# EAGLE design test (EAGLE 8.3.2)
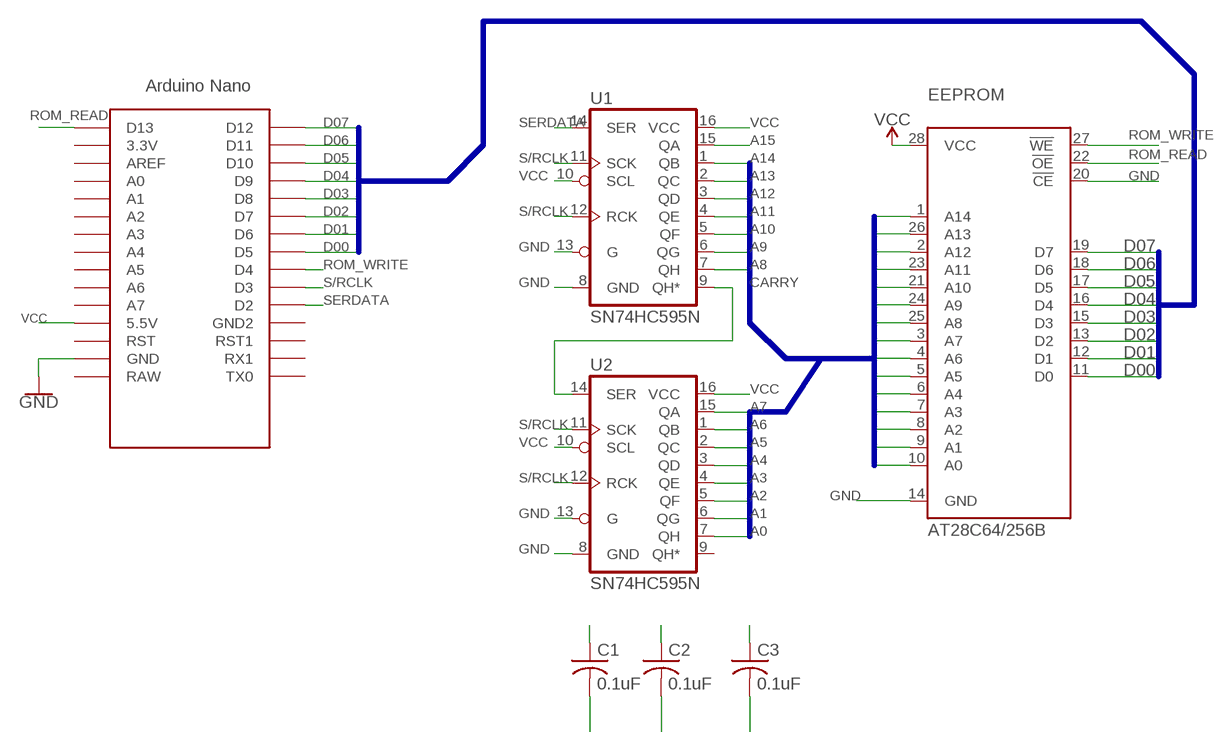
[diagram p0: schematic, sheet 1]

## Parts
C1  0.1uF  C-US025-030X050  [C025-030X050]
C2  0.1uF  C-US025-030X050  [C025-030X050]
C3  0.1uF  C-US025-030X050  [C025-030X050]
EEPROM  AT28C64/256B  28C256AP  [DIL28-6]
U1  SN74HC595N  74HC595N  [DIP16]
U2  SN74HC595N  74HC595N  [DIP16]
U$1  NANO  [NANO]

## Nets
A0: EEPROM.10(A0) U2.7(QH)
A1: EEPROM.9(A1) U2.6(QG)
A2: EEPROM.8(A2) U2.5(QF)
A3: EEPROM.7(A3) U2.4(QE)
A4: EEPROM.6(A4) U2.3(QD)
A5: EEPROM.5(A5) U2.2(QC)
A6: EEPROM.4(A6) U2.1(QB)
A7: EEPROM.3(A7) U2.15(QA)
A8: EEPROM.25(A8) U1.7(QH)
A9: EEPROM.24(A9) U1.6(QG)
A10: EEPROM.21(A10) U1.5(QF)
A11: EEPROM.23(A11) U1.4(QE)
A12: EEPROM.2(A12) U1.3(QD)
A13: EEPROM.26(A13) U1.2(QC)
A14: EEPROM.1(A14) U1.1(QB)
A15: U1.15(QA)
CARRY: U1.9(QH*) U2.14(SER)
D00: EEPROM.11(D0) U$1.D5
D01: EEPROM.12(D1) U$1.D6
D02: EEPROM.13(D2) U$1.D7
D03: EEPROM.15(D3) U$1.D8
D04: EEPROM.16(D4) U$1.D9
D05: EEPROM.17(D5) U$1.D10
D06: EEPROM.18(D6) U$1.D11
D07: EEPROM.19(D7) U$1.D12
GND [thick]: C1.2 C2.2 C3.2 EEPROM.14(GND) EEPROM.20(!CE) U1.8(GND) U1.13(G) U2.8(GND) U2.13(G) U$1.GND
ROM_READ: EEPROM.22(!OE) U$1.D13
ROM_WRITE: EEPROM.27(!WE) U$1.D4
S/RCLK: U1.11(SCK) U1.12(RCK) U2.11(SCK) U2.12(RCK) U$1.D3
SERDATA: U1.14(SER) U$1.D2
VCC [thick]: C1.1 C2.1 C3.1 EEPROM.28(VCC) U1.10(SCL) U1.16(VCC) U2.10(SCL) U2.16(VCC) U$1.5V(5.5V)
Unconnected: U2.9(QH*) U$1.3.3V U$1.A0 U$1.A1 U$1.A2 U$1.A3 U$1.A4 U$1.A5 U$1.A6 U$1.A7 U$1.AREF U$1.GND1(GND2) U$1.ICSP1 U$1.ICSP2 U$1.ICSP3 U$1.ICSP4 U$1.ICSP5 U$1.ICSP6 U$1.RAW U$1.RST U$1.RST1 U$1.RX1 U$1.TX0

## Buses
D[0..7]
A[0..14]

## Library data of the parts
C1-C3 = adafruit:C-US: CAPACITOR, American symbol
EEPROM = microchip:28*256A: CMOS EEPROM 256 K (32 K x 8), low voltage; MPN: AT28C256B-15PU; OC_FARNELL: 1631144; OC_NEWARK: 96K6557
U1 U2 = SparkFun-IC-Logic:74*595: 8-Bit Shift Register (Serial to Parallel) Datasheet <http://cdn.sparkfun.com/datasheets/BreakoutBoards/MM74HC595.pdf> SparkFun Products SparkFun Shift Register Breakout - 74HC595 <https://www.sparkfun.com/products/10680> (BOB-10680); PROD_ID: IC-13123
U$1 = Arduino-clone:NANO: Arduino Nano

## Net classes
0 default: width 0.254 mm, drill 0.254 mm, clearance 0.254 mm
1 thick: width 0.762 mm, drill 0.381 mm, clearance 0.381 mm

## Board
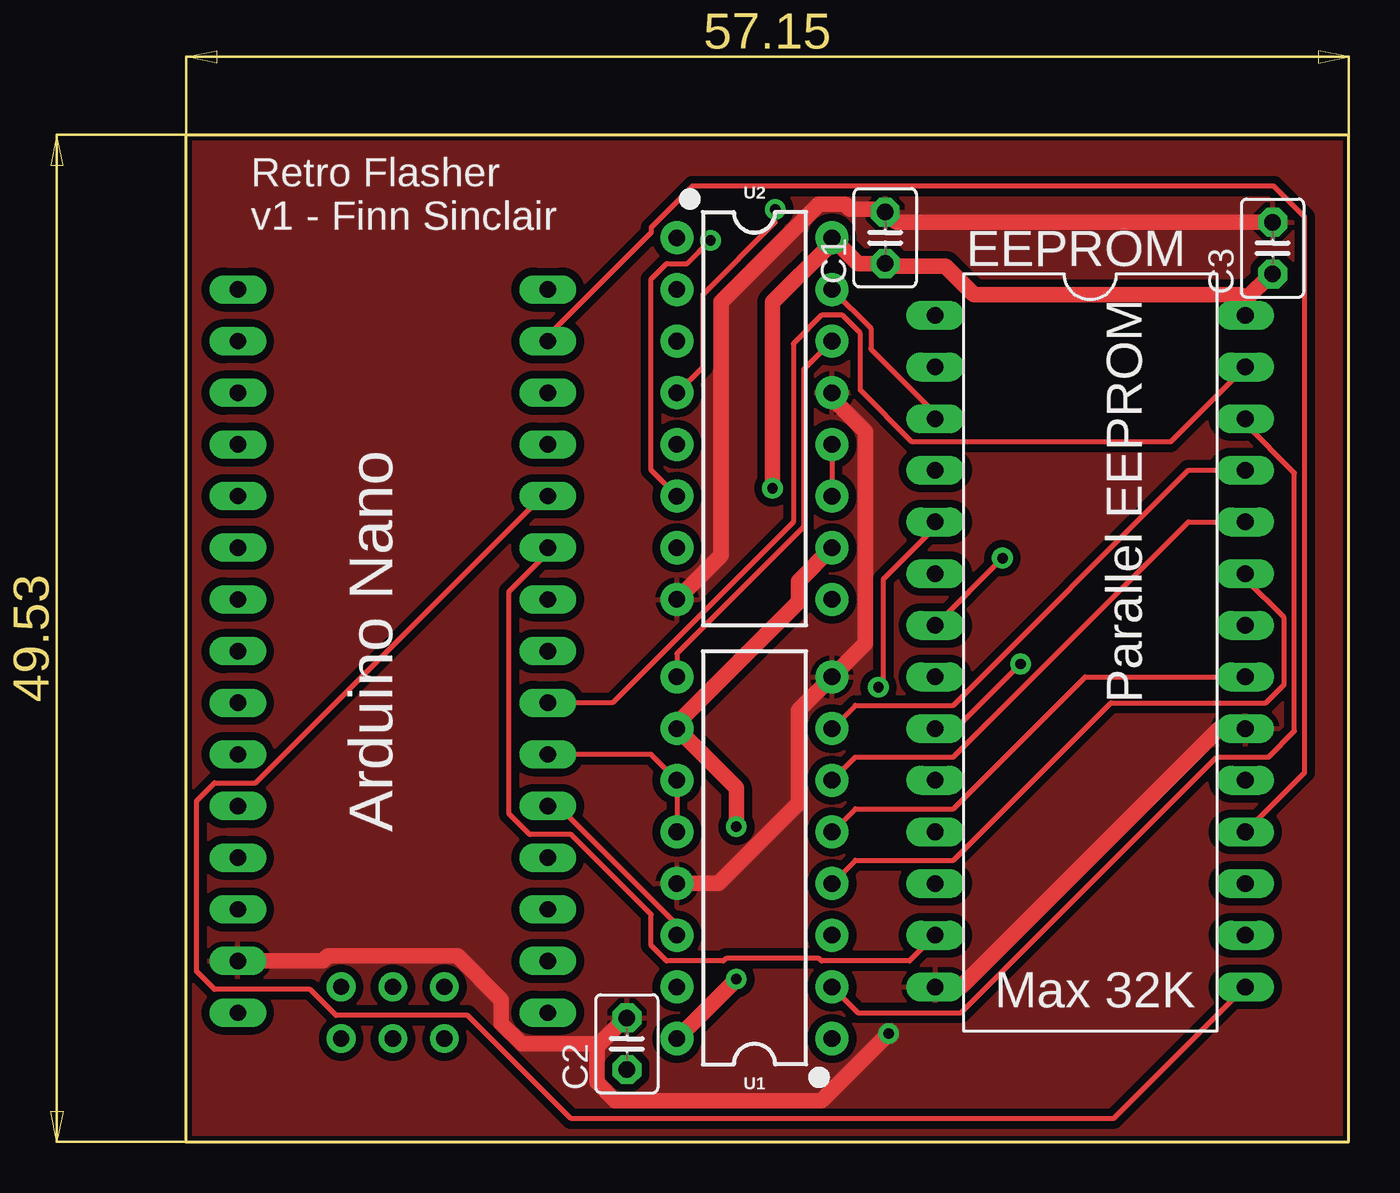
[diagram p1: board, top side]
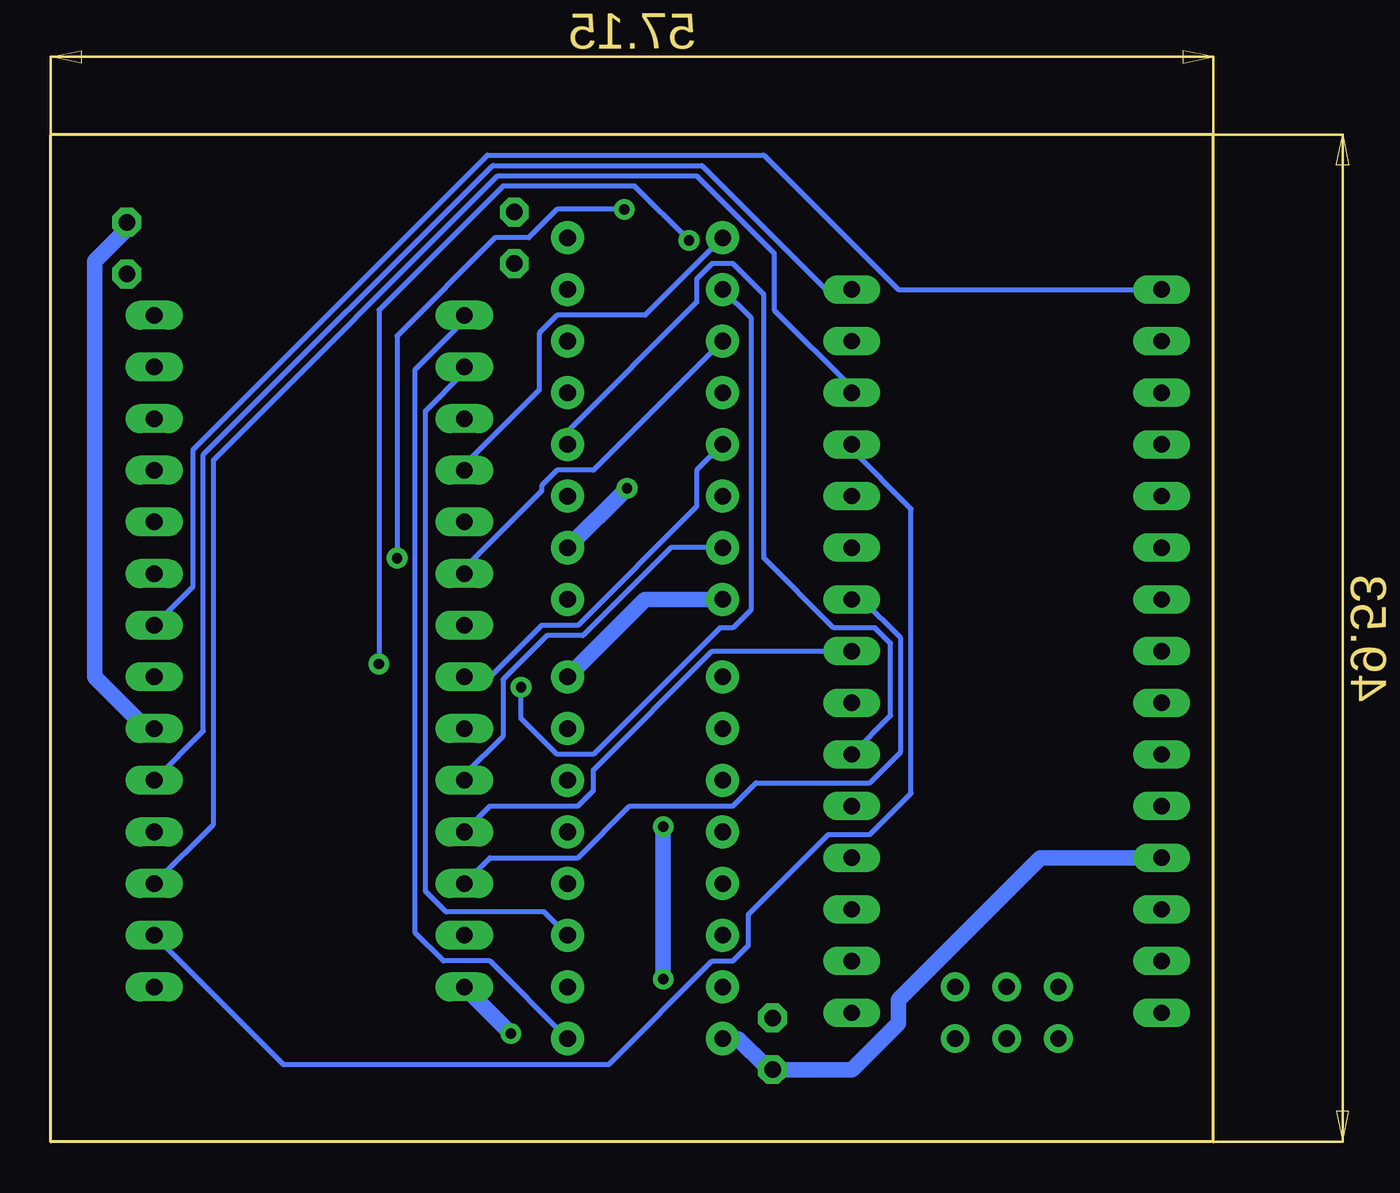
[diagram p2: board, bottom side, seen from below]

Size 57.15 x 49.53 mm. Coordinates in mm from the lower left corner, seen from the top.
Outline: 0,0 57.15,0 57.15,49.53 0,49.53 0,0
Copper layers (1*16): Top 0.035mm / dielectric 1.5mm / Bottom 0.035mm
Design rules "SparkFun": minimum track width 8mil, minimum drill 20mil, track to track 8mil, track to pad 8mil, pad to pad 8mil, via to via 8mil, smd to smd 8mil, copper to edge 8mil, drill to drill 8mil, minimum pad ring 12mil, minimum via ring 10mil, stop-mask expansion 4mil, vias tented up to drill 20mil, thermal gap 10mil

### Footprints (pad centres in the part's own frame; a part is rotated, then mirrored left to right if it is on the bottom)
C025-030X050 = drill 0.813 pad 1.422 octagon: 1 -1.27,0; 2 1.27,0
DIL28-6 = drill 0.813 long: 1 -16.51,-7.62; 2 -13.97,-7.62; 3 -11.43,-7.62; 4 -8.89,-7.62; 5 -6.35,-7.62; 6 -3.81,-7.62; 7 -1.27,-7.62; 8 1.27,-7.62; 9 3.81,-7.62; 10 6.35,-7.62; 11 8.89,-7.62; 12 11.43,-7.62; 13 13.97,-7.62; 14 16.51,-7.62; 15 16.51,7.62; 16 13.97,7.62; 17 11.43,7.62; 18 8.89,7.62; 19 6.35,7.62; 20 3.81,7.62; 21 1.27,7.62; 22 -1.27,7.62; 23 -3.81,7.62; 24 -6.35,7.62; 25 -8.89,7.62; 26 -11.43,7.62; 27 -13.97,7.62; 28 -16.51,7.62
DIP16 = drill 0.813 pad 1.626: 1 -8.89,-3.81; 2 -6.35,-3.81; 3 -3.81,-3.81; 4 -1.27,-3.81; 5 1.27,-3.81; 6 3.81,-3.81; 7 6.35,-3.81; 8 8.89,-3.81; 9 8.89,3.81; 10 6.35,3.81; 11 3.81,3.81; 12 1.27,3.81; 13 -1.27,3.81; 14 -3.81,3.81; 15 -6.35,3.81; 16 -8.89,3.81
NANO = drill 0.8 long: 3.3V -10.16,24.13; 5V -10.16,-1.27; A0 -10.16,19.05; A1 -10.16,16.51; A2 -10.16,13.97; A3 -10.16,11.43; A4 -10.16,8.89; A5 -10.16,6.35; A6 -10.16,3.81; A7 -10.16,1.27; AREF -10.16,21.59; D2 5.08,1.27; D3 5.08,3.81; D4 5.08,6.35; D5 5.08,8.89; D6 5.08,11.43; D7 5.08,13.97; D8 5.08,16.51; D9 5.08,19.05; D10 5.08,21.59; D11 5.08,24.13; D12 5.08,26.67; D13 -10.16,26.67; GND -10.16,-6.35; GND1 5.08,-1.27; RAW -10.16,-8.89; RST -10.16,-3.81; RST1 5.08,-3.81; RX1 5.08,-6.35; TX0 5.08,-8.89 | drill 0.8: ICSP1 -5.08,-10.16; ICSP2 -5.08,-7.62; ICSP3 -2.54,-10.16; ICSP4 -2.54,-7.62; ICSP5 0,-10.16; ICSP6 0,-7.62

### Placement (x,y rotation side)
C1  34.37,44.45 90 top
C2  21.67,4.83 90 top
C3  53.42,43.94 90 top
EEPROM  44.45,24.13 270 top
U1  27.94,13.97 90 top
U2  27.94,35.56 270 top
U$1  12.7,15.24 0 top

### Tracks (layer width: path | path; a pad name or v marks a point on that pad's centre or on a via)
A0
  Bottom 0.254: EEPROM.10 36.83,18.03 34.92,19.94 34.92,22.73 32.77,24.89 30.99,24.89 26.67,29.21 U2.7
A1  (via drill 0.51)
  Top 0.254: EEPROM.9 37.85,20.32 v41.02,23.5 | v25.78,44.32 24.64,43.18 23.62,43.18 22.86,42.42 22.86,33.02 U2.6
  Bottom 0.254: v41.02,23.5 41.02,40.89 34.92,46.99 28.45,46.99 v25.78,44.32
A2
  Bottom 0.254: EEPROM.8 35.56,22.86 33.02,25.4 31.24,25.4 25.4,31.24 25.4,33.02 U2.5
A3  (via drill 0.51)
  Top 0.254: v40.13,28.7 EEPROM.7 | v28.96,45.85 28.96,45.21 25.4,41.66 25.4,38.1 U2.4
  Bottom 0.254: v40.13,28.7 40.13,39.62 35.31,44.45 33.66,44.45 32.26,45.85 v28.96,45.85
A4
  Bottom 0.254: EEPROM.6 36.83,28.19 33.02,32 33.02,32.26 32.26,33.02 30.48,33.02 U2.3
A5  (via drill 0.51)
  Top 0.254: EEPROM.5 36.83,30.23 34.29,27.69 34.29,22.61 v34.04,22.35
  Bottom 0.254: v34.04,22.35 34.04,20.83 32.26,19.05 30.48,19.05 24.26,25.27 23.62,25.27 22.73,26.16 22.73,40.51 U2.2
A6
  Bottom 0.254: EEPROM.4 36.83,33.27 33.15,36.96 33.15,39.75 32.26,40.64 27.94,40.64 U2.1
A7
  Top 0.254: EEPROM.3 36.83,35.81 33.66,38.99 33.66,40.01 U2.15
A8
  Top 0.254: EEPROM.25 49.28,33.02 37.72,21.46 32.89,21.46 U1.7
A9
  Top 0.254: EEPROM.24 49.28,30.48 37.72,18.92 32.89,18.92 U1.6
A10
  Top 0.254: EEPROM.21 44.2,22.86 37.72,16.38 32.89,16.38 U1.5
A11
  Top 0.254: EEPROM.23 52.07,27.69 53.98,25.78 53.98,22.48 53.09,21.59 45.47,21.59 37.72,13.84 32.89,13.84 U1.4
A12
  Bottom 0.254: EEPROM.2 36.83,37.85 38.73,35.94 38.73,12.32 37.72,11.3 32.89,11.3 U1.3
A13
  Top 0.254: EEPROM.26 52.07,35.31 54.48,32.89 54.48,20.19 53.21,18.92 50.67,18.92 38.1,6.35 33.02,6.35 U1.2
A14
  Bottom 0.254: EEPROM.1 36.83,40.39 39.24,37.97 39.24,10.29 37.85,8.89 35.56,8.89 U1.1
CARRY
  Top 0.254: U1.9 24.13,24 30.35,30.23 30.35,37.97 U2.14
D00
  Bottom 0.254: U$1.D5 24.64,24.13 30.48,18.29 30.48,17.27 31.24,16.51 35.56,16.51 EEPROM.11
D01
  Bottom 0.254: U$1.D6 17.27,26.67 15.37,24.77 15.37,19.18 16.89,17.65 22.48,17.65 23.62,16.51 28.7,16.51 31.24,13.97 35.56,13.97 EEPROM.12
D02
  Top 0.254: U$1.D7 17.78,28.96 15.88,27.05 15.88,16.13 16.89,15.11 18.92,15.11 22.86,11.18 22.86,9.65 23.62,8.89 26.42,8.89 26.54,9.02 31.11,9.02 31.24,8.89 35.56,8.89 EEPROM.13
D03
  Top 0.254: U$1.D8 17.53,31.75 3.43,17.65 1.4,17.65 0.51,16.76 0.51,8.38 1.4,7.49 6.1,7.49 7.37,6.22 13.84,6.22 18.92,1.14 45.59,1.14 EEPROM.15
D04
  Bottom 0.254: U$1.D9 17.78,34.04 14.86,31.11 14.86,17.14 16.89,15.11 18.92,15.11 22.86,11.18 22.86,9.65 23.62,8.89 24.64,8.89 29.72,3.81 45.72,3.81 EEPROM.16
D05
  Bottom 0.254: U$1.D10 17.78,37.08 21.59,40.89 21.59,43.69 25.4,47.5 35.18,47.5 49.15,33.53 49.15,15.62 EEPROM.17
D06
  Top 0.254: U$1.D11 17.78,39.62 22.86,44.7 22.86,44.96 24.89,46.99 53.47,46.99 54.99,45.47 54.99,18.16 EEPROM.18
D07
  Bottom 0.254: U$1.D12 19.05,41.91 25.15,48.01 35.43,48.01 49.66,33.78 49.66,20.19 EEPROM.19
GND  (via drill 0.51)
  Top 0.762: C3.2 34.92,45.21 34.42,45.72 C1.2 34.04,45.85 32.64,45.85 32.38,46.1 31.11,46.1 26.29,41.27 26.29,28.83 U2.8 | U1.13 26.16,12.7 30.1,16.64 30.1,21.21 U1.8 33.4,24.51 33.4,34.92 31.75,36.58 U2.13 | U$1.GND 6.73,8.89 6.99,9.14 13.34,9.14 15.49,6.99 15.49,5.84 16.51,4.83 20.19,4.83 | 20.19,4.83 20.32,4.83 21.59,6.1 C2.2 | EEPROM.14 38.1,7.62 50.8,20.32 EEPROM.20 | 20.19,4.83 20.19,2.92 21.08,2.03 31.24,2.03 v34.54,5.33
  Bottom 0.762: U2.8 27.94,26.67 U1.8 | EEPROM.14 v34.54,5.33 | EEPROM.20 52.45,20.32 54.99,22.86 54.99,43.31 53.47,44.83 53.47,45.21 C3.2
  pour Top: 0,49.53 57.15,49.53 57.15,0 0,0
ROM_READ
  Bottom 0.254: U$1.D13 15.49,41.91 22.1,48.51 35.69,48.51 50.16,34.04 50.16,27.3 EEPROM.22
ROM_WRITE
  Top 0.254: U$1.D4 20.95,21.59 29.84,30.48 29.84,39.24 31.24,40.64 32.26,40.64 33.15,39.75 33.15,36.96 35.69,34.42 48.39,34.42 EEPROM.27
S/RCLK
  Top 0.254: U2.12 U2.11 | U$1.D3 22.86,19.05 U1.11 U1.12
  Bottom 0.254: U2.12 31.75,34.92 25.4,41.27 25.4,42.42 24.64,43.18 23.62,43.18 22.1,41.66 22.1,28.7 18.67,25.27 16.64,25.27 15.88,24.51 15.88,20.95 U$1.D3
SERDATA
  Top 0.254: U$1.D2 18.29,16.51 24.13,10.67 U1.14
VCC  (via drill 0.51)
  Top 0.762: U2.10 30.1,27.56 30.1,26.54 24.13,20.57 U1.10 27.05,17.4 v27.05,15.49 | 52.07,41.4 EEPROM.28 | 52.07,41.4 53.34,42.67 C3.1 | 52.07,41.4 51.82,41.66 38.73,41.66 37.34,43.05 34.67,43.05 C1.1 33.02,43.18 U2.16 31.62,44.07 28.83,41.27 v28.83,32.13 | v27.05,8 U1.16
  Bottom 0.762: U$1.5V 8.51,13.97 15.49,6.99 15.49,5.84 17.78,3.56 C2.1 21.97,3.68 23.37,5.08 U1.16 | v28.83,32.13 U2.10 | v27.05,15.49 v27.05,8

### Text on the board
tPlace: Retro Flasher / v1 - Finn Sinclair | Parallel EEPROM | Arduino Nano | Max 32K